# Altium schematic sheet Memory.SchDoc
size A4
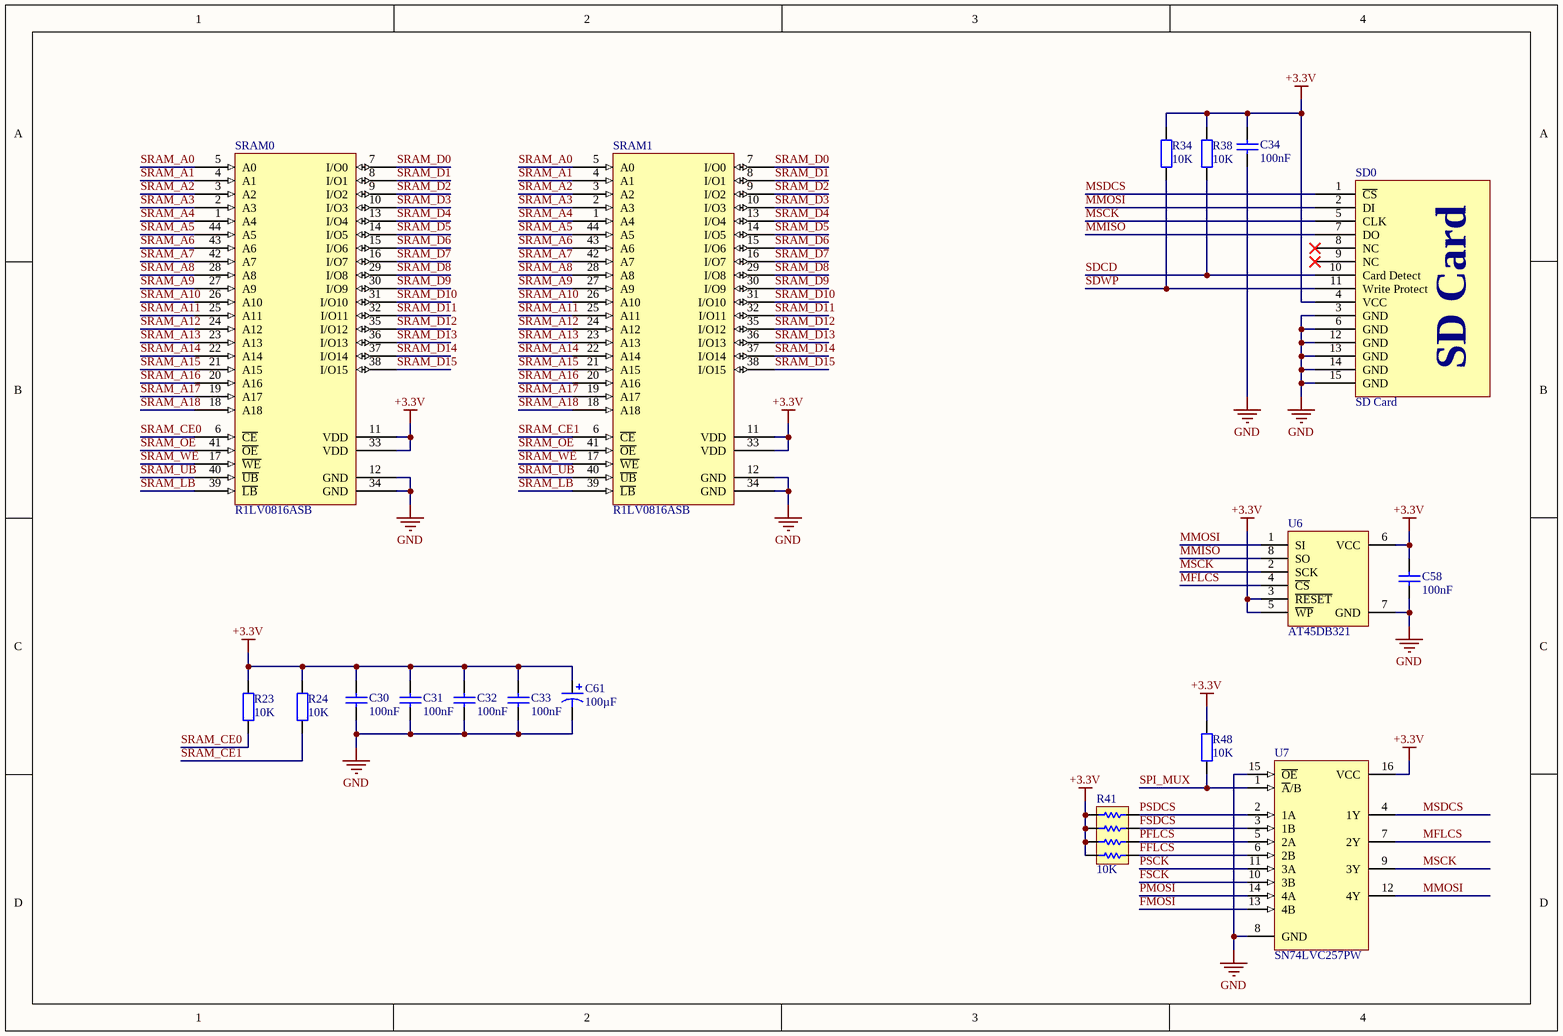
[diagram p0: Memory.SchDoc]

## Parts
C30  value 100nF  [6-0805_n]  (hidden comment: Cap)
C31  value 100nF  [6-0805_n]  (hidden comment: Cap)
C32  value 100nF  [6-0805_n]  (hidden comment: Cap)
C33  value 100nF  [6-0805_n]  (hidden comment: Cap)
C34  value 100nF  [6-0805_n]  (hidden comment: Cap)
C58  value 100nF  [6-0805_n]  (hidden comment: Cap)
C61  value 100µF  [ECAP 6.3mm]  (hidden comment: Cap Pol3)
R23  value 10K  [6-0805_N]  (hidden comment: Res2)
R24  value 10K  [6-0805_N]  (hidden comment: Res2)
R34  value 10K  [6-0805_N]  (hidden comment: Res2)
R38  value 10K  [6-0805_N]  (hidden comment: Res2)
R41  10K  [SMD 4 Resisor Network]
R48  value 10K  [6-0805_N]  (hidden comment: Res2)
SD0  SD Card  [SD-Card Connector OK]
SRAM0  R1LV0816ASB  [TSOP44]
SRAM1  R1LV0816ASB  [TSOP44]
U6  AT45DB321  [SOIC8]
U7  SN74LVC257PW  [PW016_N]

## Nets
+3.3V: C30.2 C31.2 C32.2 C33.2 C34.2 C58.2 C61.1 R23.1 R24.1 R34.1 R38.1 R41.1 R41.3 R41.5 R41.7 R48.1 SD0.4(VCC) SRAM0.11(VDD) SRAM0.33(VDD) SRAM1.11(VDD) SRAM1.33(VDD) U6.3(~{RESET}) U6.5(~{WP}) U6.6(VCC) U7.16(VCC)
GND: C30.1 C31.1 C32.1 C33.1 C34.1 C58.1 C61.2 SD0.3(GND) SD0.6(GND) SD0.12(GND) SD0.13(GND) SD0.14(GND) SD0.15(GND) SRAM0.12(GND) SRAM0.34(GND) SRAM1.12(GND) SRAM1.34(GND) U6.7(GND) U7.8(GND) U7.15(~{OE})
FFLCS: R41.8 U7.6(2B)
FMOSI: U7.13(4B)
FSCK: U7.10(3B)
FSDCS: R41.4 U7.3(1B)
MFLCS: U6.4(~{CS}) U7.7(2Y)
MMISO: SD0.7(DO) U6.8(SO)
MMOSI: SD0.2(DI) U6.1(SI) U7.12(4Y)
MSCK: SD0.5(CLK) U6.2(SCK) U7.9(3Y)
MSDCS: SD0.1(~{CS}) U7.4(1Y)
PFLCS: R41.6 U7.5(2A)
PMOSI: U7.14(4A)
PSCK: U7.11(3A)
PSDCS: R41.2 U7.2(1A)
SDCD: R38.2 SD0.10(Card_Detect)
SDWP: R34.2 SD0.11(Write_Protect)
SPI_MUX: R48.2 U7.1(~{A}/B)
SRAM_A0: SRAM0.5(A0) SRAM1.5(A0)
SRAM_A1: SRAM0.4(A1) SRAM1.4(A1)
SRAM_A2: SRAM0.3(A2) SRAM1.3(A2)
SRAM_A3: SRAM0.2(A3) SRAM1.2(A3)
SRAM_A4: SRAM0.1(A4) SRAM1.1(A4)
SRAM_A5: SRAM0.44(A5) SRAM1.44(A5)
SRAM_A6: SRAM0.43(A6) SRAM1.43(A6)
SRAM_A7: SRAM0.42(A7) SRAM1.42(A7)
SRAM_A8: SRAM0.28(A8) SRAM1.28(A8)
SRAM_A9: SRAM0.27(A9) SRAM1.27(A9)
SRAM_A10: SRAM0.26(A10) SRAM1.26(A10)
SRAM_A11: SRAM0.25(A11) SRAM1.25(A11)
SRAM_A12: SRAM0.24(A12) SRAM1.24(A12)
SRAM_A13: SRAM0.23(A13) SRAM1.23(A13)
SRAM_A14: SRAM0.22(A14) SRAM1.22(A14)
SRAM_A15: SRAM0.21(A15) SRAM1.21(A15)
SRAM_A16: SRAM0.20(A16) SRAM1.20(A16)
SRAM_A17: SRAM0.19(A17) SRAM1.19(A17)
SRAM_A18: SRAM0.18(A18) SRAM1.18(A18)
SRAM_CE0: R23.2 SRAM0.6(~{CE})
SRAM_CE1: R24.2 SRAM1.6(~{CE})
SRAM_D0: SRAM0.7(I/O0) SRAM1.7(I/O0)
SRAM_D1: SRAM0.8(I/O1) SRAM1.8(I/O1)
SRAM_D2: SRAM0.9(I/O2) SRAM1.9(I/O2)
SRAM_D3: SRAM0.10(I/O3) SRAM1.10(I/O3)
SRAM_D4: SRAM0.13(I/O4) SRAM1.13(I/O4)
SRAM_D5: SRAM0.14(I/O5) SRAM1.14(I/O5)
SRAM_D6: SRAM0.15(I/O6) SRAM1.15(I/O6)
SRAM_D7: SRAM0.16(I/O7) SRAM1.16(I/O7)
SRAM_D8: SRAM0.29(I/O8) SRAM1.29(I/O8)
SRAM_D9: SRAM0.30(I/O9) SRAM1.30(I/O9)
SRAM_D10: SRAM0.31(I/O10) SRAM1.31(I/O10)
SRAM_D11: SRAM0.32(I/O11) SRAM1.32(I/O11)
SRAM_D12: SRAM0.35(I/O12) SRAM1.35(I/O12)
SRAM_D13: SRAM0.36(I/O13) SRAM1.36(I/O13)
SRAM_D14: SRAM0.37(I/O14) SRAM1.37(I/O14)
SRAM_D15: SRAM0.38(I/O15) SRAM1.38(I/O15)
SRAM_LB: SRAM0.39(~{LB}) SRAM1.39(~{LB})
SRAM_OE: SRAM0.41(~{OE}) SRAM1.41(~{OE})
SRAM_UB: SRAM0.40(~{UB}) SRAM1.40(~{UB})
SRAM_WE: SRAM0.17(~{WE}) SRAM1.17(~{WE})

Not connected (* = marked no-connect by the designer): SD0 8(NC)* 9(NC)*

## Notes on the sheet
- Title
- Size:
- Date:
- A4
- Number:
- Time:
- Revision:
- Sheet
- of
- File:

## Library data of the parts
C30-C34 C58 = Cap: Capacitor; Published: 8-Jun-2000; LatestRevisionDate: 17-Jul-2002; LatestRevisionNote: Re-released for DXP Platform.; PackageReference: RAD-0.3; Publisher: Altium Limited; PackageDescription: Radial Cap, Thru-Hole; 2 Leads; 0.3 in Pin Spacing
C61 = Cap Pol3: Polarized Capacitor (Surface Mount); Published: 8-Jun-2000; LatestRevisionDate: 29-May-2009; LatestRevisionNote: IPC-7351 Footprint Added.; PackageReference: C0805; Publisher: Altium Limited; PackageDescription: Chip Capacitor
R23 R24 R34 R38 R48 = Res2: Resistor; Published: 8-Jun-2000; LatestRevisionDate: 17-Jul-2002; LatestRevisionNote: Re-released for DXP Platform.; PackageReference: AXIAL-0.4; Publisher: Altium Limited; PackageDescription: Axial Device, Thru-Hole; 2 Leads; 0.4 in Pin Spacing
R41 = SMD 4 Resistor Network
SD0 = SD Card Connector
SRAM0 SRAM1 = R1LV0816ASB: 8Mbit (512Kb x 16) Asynchron Static RAM
U6 = AT45DB321D
U7 = SN74LVC257PW: Quadruple 2-Line to 1-Line Data Selector/Multiplexer with 3-State Outputs; ComponentAvailability: Not Available; Published: 8-Jun-2000; LatestRevisionDate: 29-Mar-2007; LatestRevisionNote: IPC-7351 Footprint Added.; DatasheetVersion: Jul-1995; PackageVersion: Feb-1999; PackageReference: PW016; Publisher: Altium Limited; PackageDescription: 16-Pin Thin Small Outline Package 0.65 mm Pitch; ComponentLink1Description: Manufacturer Link; ComponentLink1URL: http://www.ti.com/; ComponentLink2Description: Discontinuation Notice; ComponentLink2URL: http://focus.ti.com/pdfs/mltry/obsolete.pdf